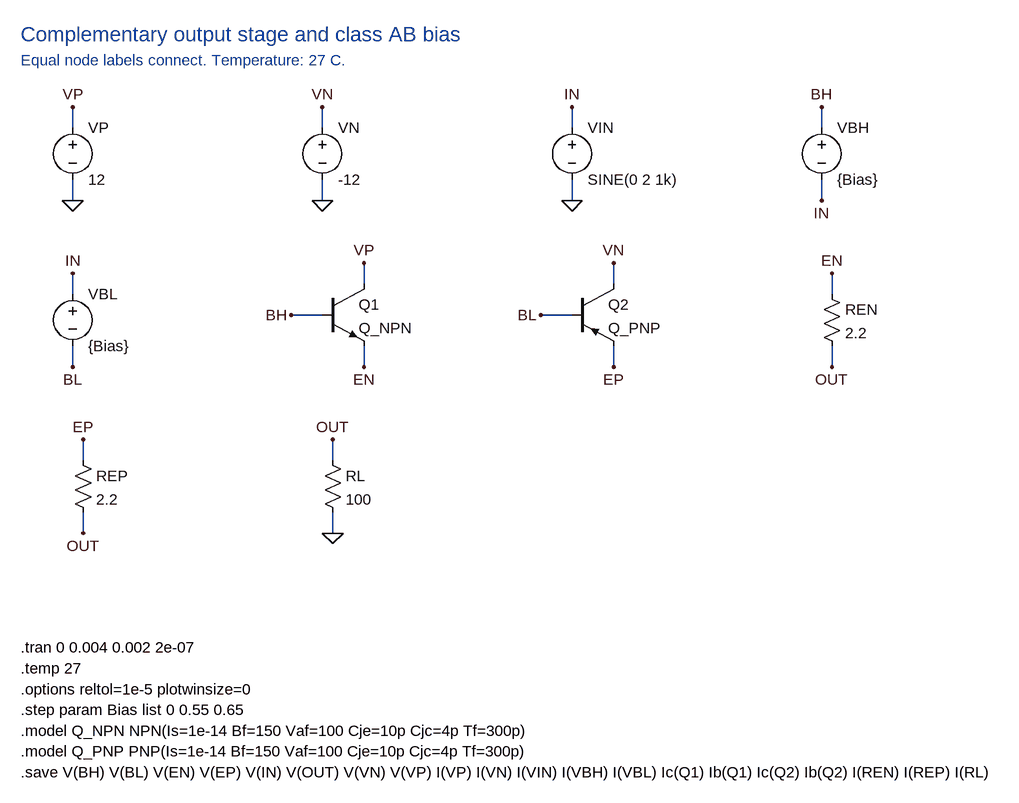
[diagram p0: schematic complementary-output-stage.asc]
complementary-output-stage.asc, the LTspice schematic file:
Version 4
SHEET 1 1740 1320
WIRE 144 176 144 144
WIRE 144 256 144 288
WIRE 528 176 528 144
WIRE 528 256 528 288
WIRE 912 176 912 144
WIRE 912 256 912 288
WIRE 1296 176 1296 144
WIRE 1296 256 1296 288
WIRE 144 432 144 400
WIRE 144 512 144 544
WIRE 592 416 592 384
WIRE 528 464 480 464
WIRE 592 512 592 544
WIRE 976 416 976 384
WIRE 912 464 864 464
WIRE 976 512 976 544
WIRE 1312 432 1312 400
WIRE 1312 512 1312 544
WIRE 160 688 160 656
WIRE 160 768 160 800
WIRE 544 688 544 656
WIRE 544 768 544 800
FLAG 144 144 VP
FLAG 144 288 0
FLAG 528 144 VN
FLAG 528 288 0
FLAG 912 144 IN
FLAG 912 288 0
FLAG 1296 144 BH
FLAG 1296 288 IN
FLAG 144 400 IN
FLAG 144 544 BL
FLAG 592 384 VP
FLAG 480 464 BH
FLAG 592 544 EN
FLAG 976 384 VN
FLAG 864 464 BL
FLAG 976 544 EP
FLAG 1312 400 EN
FLAG 1312 544 OUT
FLAG 160 656 EP
FLAG 160 800 OUT
FLAG 544 656 OUT
FLAG 544 800 0
SYMBOL voltage 144 160 R0
SYMATTR InstName VP
SYMATTR Value 12
SYMBOL voltage 528 160 R0
SYMATTR InstName VN
SYMATTR Value -12
SYMBOL voltage 912 160 R0
SYMATTR InstName VIN
SYMATTR Value SINE(0 2 1k)
SYMBOL voltage 1296 160 R0
SYMATTR InstName VBH
SYMATTR Value {Bias}
SYMBOL voltage 144 416 R0
SYMATTR InstName VBL
SYMATTR Value {Bias}
SYMBOL npn 528 416 R0
SYMATTR InstName Q1
SYMATTR Value Q_NPN
SYMBOL pnp 912 416 R0
SYMATTR InstName Q2
SYMATTR Value Q_PNP
SYMBOL res 1296 416 R0
SYMATTR InstName REN
SYMATTR Value 2.2
SYMBOL res 144 672 R0
SYMATTR InstName REP
SYMATTR Value 2.2
SYMBOL res 528 672 R0
SYMATTR InstName RL
SYMATTR Value 100
TEXT 64 32 Left 3 ;Complementary output stage and class AB bias
TEXT 64 72 Left 2 ;Equal node labels connect. Temperature: 27 C.
TEXT 64 976 Left 2 !.tran 0 0.004 0.002 2e-07
TEXT 64 1008 Left 2 !.temp 27
TEXT 64 1040 Left 2 !.options reltol=1e-5 plotwinsize=0
TEXT 64 1072 Left 2 !.step param Bias list 0 0.55 0.65
TEXT 64 1104 Left 2 !.model Q_NPN NPN(Is=1e-14 Bf=150 Vaf=100 Cje=10p Cjc=4p Tf=300p)
TEXT 64 1136 Left 2 !.model Q_PNP PNP(Is=1e-14 Bf=150 Vaf=100 Cje=10p Cjc=4p Tf=300p)
TEXT 64 1168 Left 2 !.save V(BH) V(BL) V(EN) V(EP) V(IN) V(OUT) V(VN) V(VP) I(VP) I(VN) I(VIN) I(VBH) I(VBL) Ic(Q1) Ib(Q1) Ic(Q2) Ib(Q2) I(REN) I(REP) I(RL)

The netlist it stands for:
* complementary-output-stage.asc
VP VP 0 12
VN VN 0 -12
VIN IN 0 SINE(0 2 1k)
VBH BH IN {Bias}
VBL IN BL {Bias}
Q1 VP BH EN 0 Q_NPN
Q2 VN BL EP 0 Q_PNP
REN EN OUT 2.2
REP EP OUT 2.2
RL OUT 0 100
.model NPN NPN
.model PNP PNP
.lib standard.bjt
* Complementary output stage and class AB bias
* Equal node labels connect. Temperature: 27 C.
.tran 0 0.004 0.002 2e-07
.temp 27
.options reltol=1e-5 plotwinsize=0
.step param Bias list 0 0.55 0.65
.model Q_NPN NPN(Is=1e-14 Bf=150 Vaf=100 Cje=10p Cjc=4p Tf=300p)
.model Q_PNP PNP(Is=1e-14 Bf=150 Vaf=100 Cje=10p Cjc=4p Tf=300p)
.save V(BH) V(BL) V(EN) V(EP) V(IN) V(OUT) V(VN) V(VP) I(VP) I(VN) I(VIN) I(VBH) I(VBL) Ic(Q1) Ib(Q1) Ic(Q2) Ib(Q2) I(REN) I(REP) I(RL)
.backanno
.end